# Altium schematic sheet OC_Trigger.SchDoc
size A4; CompanyName: Technische Hochschule Nürnberg Georg Simon Ohm; Organization: UltraZohm; Address1: Kesslerplatz 12; Address2: 90489 Nürnberg; Address3: GERMANY; Website: www.ultrazohm.com
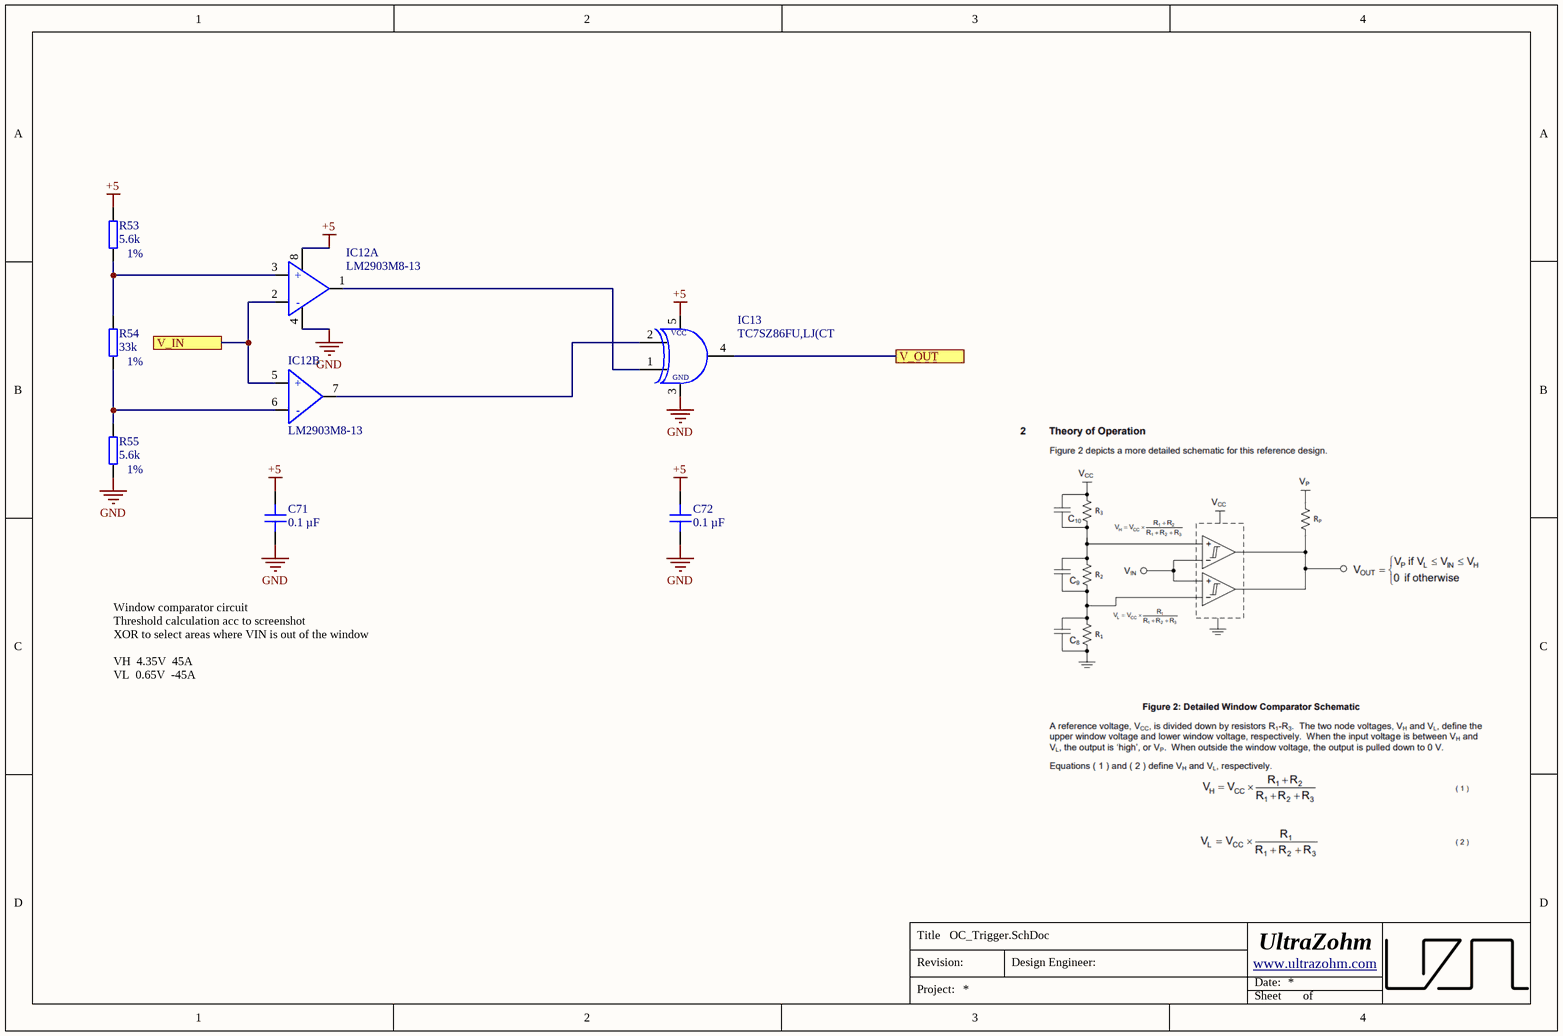
[diagram p0: OC_Trigger.SchDoc]

## Parts
C71  0.1 µF  [C_0603]
C72  0.1 µF  [C_0603]
IC12  LM2903M8-13  [MSOP-8 (RM-8)]  (parts A,B of 2)
IC13  TC7SZ86FU,LJ(CT  [SOT353-1_N]
R53  5.6k  Tolerance: 1%  [RES 0603_1608]
R54  33k  Tolerance: 1%  [RES 0603_1608]
R55  5.6k  Tolerance: 1%  [RES 0603_1608]

## Ports
V_IN, V_OUT

## Nets
+5: C71.2 C72.2 IC12.8 IC13.5 R53.2
GND: C71.1 C72.1 IC12.4 IC13.3 R55.1
V_IN: IC12.2(-) IC12.5(+) ; port V_IN
V_OUT: IC13.4 ; port V_OUT
NetIC12_1: IC12.1 IC13.1
NetIC12_3: IC12.3(+) R53.1 R54.2
NetIC12_6: IC12.6(-) R54.1 R55.2
NetIC12_7: IC12.7 IC13.2

## Notes on the sheet
- Window comparator circuit
  Threshold calculation acc to screenshot
  XOR to select areas where VIN is out of the window
  VH  4.35V  45A
  VL  0.65V  -45A
- Title
- Revision:
- Design Engineer:
- Date:
- Project:
- Sheet
- of
- (in symbol TC7SZ86FU,LJ(CT) VCC; GND

## Library data of the parts
C71 C72 = C0603X104K5RAC7411: Capacitor 0603, 50 VDC, 0.1 µF, X7R; Manufacturer: KEMET; Tolerance: 10 %; Voltage Rating: 50 VDC; Created from: MGremer; Manufacturer Part Number: C0603X104K5RAC7411; PartID: 3; Created On: 20.12.2020 13:54:13; ComponentLink1Description: Datasheet; ComponentLink1URL: https://www.mouser.de/datasheet/2/212/1/KEM_C1013_X7R_FT_CAP_SMD-1103280.pdf; Component Type: Capacitor 0603; Device Package: 0603; Last Updated: 04.03.2021 09:24:28; Mounting Type: SMD; Operating Temperature: -55 - 125°C; Series: SMD Comm X7R Flex; Supplier 1: Mouser; Supplier Part Number 1: 80-C0603X104K5R7411; Supplier 2: LCSC; Supplier Part Number 2: C14663; Type: Capacitor; Value: 0.1 µF; Live Cycle Status: 1; LCSC Part Number: C14663; Stock number: Labor SMD Container
IC12 = LM2903M8-13: Analoge Komparatoren Comparator; Manufacturer: Diodes Incorporated; Channels: 2; Created from: VStarost; Manufacturer Part Number: LM2903M8-13; PartID: 19; Created On: 31.01.2023 09:11:50; ComponentLink1Description: Datasheet; ComponentLink1URL: https://www.mouser.de/datasheet/2/115/DIOD_S_A0006493411_1-2542964.pdf; Component Type: Dual Comparator; Device Package: MSOP-8; Last Updated: 31.01.2023 09:11:50; Mounting Type: SMD; Operating Temperature: -40 - 125°C; Series: LM2903; Supplier 1: Mouser; Supplier Part Number 1: 621-LM2903M8-13; Type: Comparator; Live Cycle Status: 1; Stock number: not stored
IC13 = TC7SZ86FU,LJ(CT: IC GATE XOR 1CH 2-INP USV; Manufacturer: Toshiba; Value: 5.5 V; Created from: VStarost; Manufacturer Part Number: TC7SZ86FU,LJ(CT; PartID: 4; Created On: 24.01.2023 08:21:29; ComponentLink1Description: Datasheet; ComponentLink1URL: https://toshiba.semicon-storage.com/info/TC7SZ86FU_datasheet_en_20170517.pdf?did=54621&prodName=TC7SZ86FU; Component Type: XOR; Device Package: SOT-353; Last Updated: 24.01.2023 08:21:29; Mounting Type: SMD; Operating Temperature: -40 - 85 °C; Series: TC7SZ86; Supplier 1: Mouser; Supplier Part Number 1: 757-TC7SZ86FULJCT; Supplier 2: Digi-Key; Supplier Part Number 2: TC7SZ86FULJ(CTCT-ND; Type: XOR; Live Cycle Status: 1; Stock number: not stored
R53 R55 = AC0603FR-075K6L: SMD resistor E24 series 5.6 kOhms 100mW 0603 1%; Manufacturer: YAGEO; Created from: VStarost; Manufacturer Part Number: AC0603FR-075K6L; PartID: 256; Created On: 10.02.2023 10:25:38; ComponentLink1Description: Datasheet; ComponentLink1URL: https://www.mouser.de/datasheet/2/447/PYu_AC_51_RoHS_L_9-3005297.pdf; Component Type: SMD resistor; Device Package: 0603; Last Updated: 15.02.2023 17:52:13; Mounting Type: SMD; Supplier 1: Mouser; Supplier Part Number 1: 603-AC0603FR-075K6L; Type: Resistor; Value: 5.6k; Live Cycle Status: 1; Stock number: not stored; LCSC Part Number: C177628
R54 = AC0603FR-1333KL: SMD resistor E24 series; Manufacturer: YAGEO; Created from: VStarost; Manufacturer Part Number: AC0603FR-1333KL; PartID: 253; Created On: 24.01.2023 09:59:41; ComponentLink1Description: Datasheet; ComponentLink1URL: https://www.mouser.de/datasheet/2/447/PYu_AC_51_RoHS_L_9-3005297.pdf; Component Type: SMD resistor; Device Package: 0603; Last Updated: 15.02.2023 17:16:43; Mounting Type: SMD; Supplier 1: Mouser; Supplier Part Number 1: 603-AC0603FR-1333KL; Type: Resistor; Value: 33k; Live Cycle Status: 1; Stock number: not stored; LCSC Part Number: C269485